# Altium schematic sheet 9V_Converter.SchDoc
size A; SheetNumber: 5; SheetTotal: 9
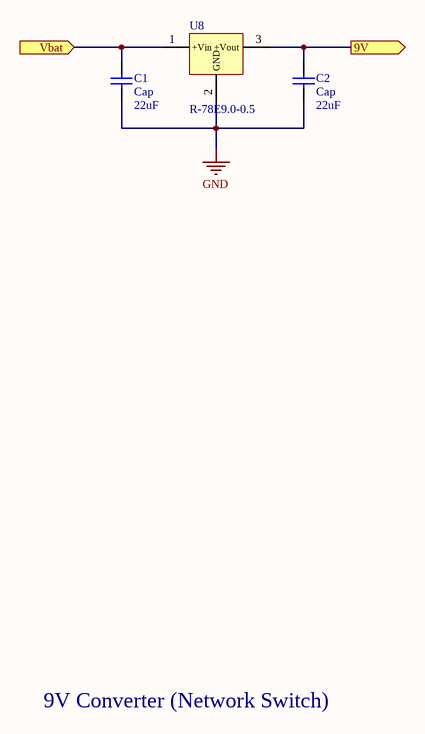
[diagram p0: 9V_Converter.SchDoc]

## Parts
C1  Cap  value 22uF  [C1206]
C2  Cap  value 22uF  [C1206]
U8  R-78E9.0-0.5  [R-78Exx-0.5]

## Ports
9V (out), Vbat (in)

## Nets
GND: C1.1 C2.1 U8.2(GND)
9V: C2.2 U8.3(+Vout) ; port 9V
Vbat: C1.2 U8.1(+Vin) ; port Vbat

## Notes on the sheet
- 9V Converter (Network Switch)

## Library data of the parts
C1 C2 = Cap Semi: Capacitor (Semiconductor SIM Model); Published: 8-Jun-2000; LatestRevisionDate: 29-May-2009; LatestRevisionNote: IPC-7351 Footprint Added.; PackageReference: C1206; Publisher: Altium Limited; PackageDescription: Chip Capacitor
U8 = R-78Exx-0.5: 0.5A DC/DC Voltage Converter; Datasheet: https://www.recom-power.com/pdf/Innoline/R-78Exx-0.5.pdf; Digikey: https://www.digikey.com/product-detail/en/recom-power/R-78E9-0-0-5/945-2638-5-ND/6010095